# Altium schematic sheet MAX232&输出.SchDoc
size A4
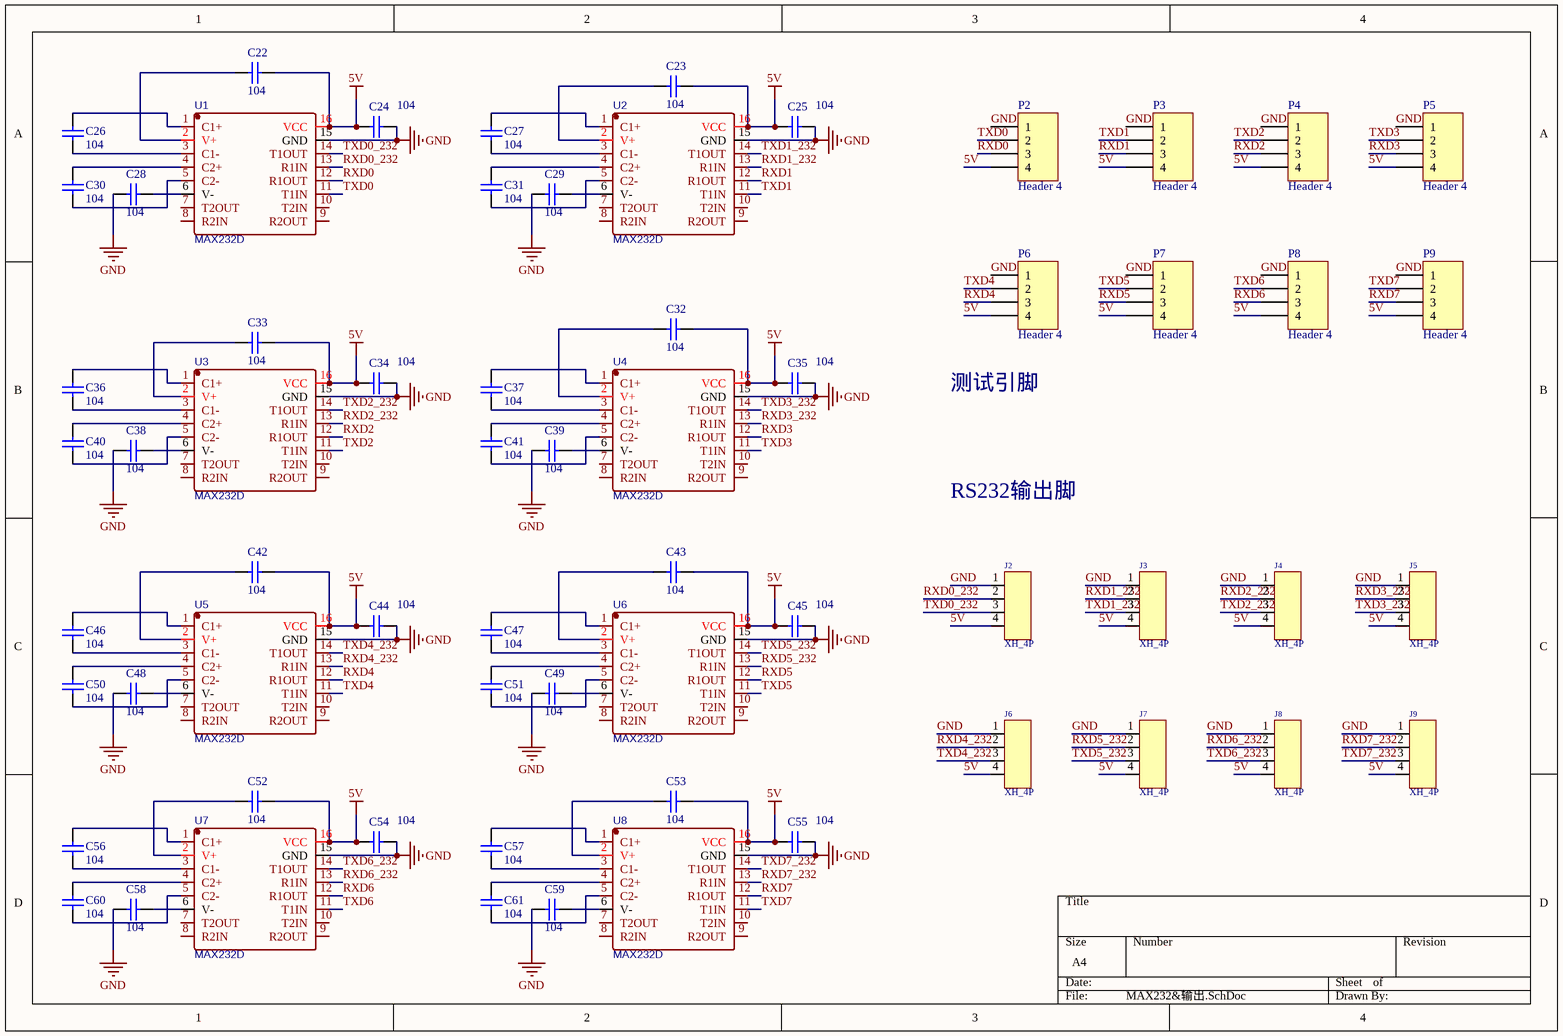
[diagram p0: MAX232&输出.SchDoc]

## Parts
C22  104  [0603_C]
C23  104  [0603_C]
C24  104  [0603_C]
C25  104  [0603_C]
C26  104  [0603_C]
C27  104  [0603_C]
C28  104  [0603_C]
C29  104  [0603_C]
C30  104  [0603_C]
C31  104  [0603_C]
C32  104  [0603_C]
C33  104  [0603_C]
C34  104  [0603_C]
C35  104  [0603_C]
C36  104  [0603_C]
C37  104  [0603_C]
C38  104  [0603_C]
C39  104  [0603_C]
C40  104  [0603_C]
C41  104  [0603_C]
C42  104  [0603_C]
C43  104  [0603_C]
C44  104  [0603_C]
C45  104  [0603_C]
C46  104  [0603_C]
C47  104  [0603_C]
C48  104  [0603_C]
C49  104  [0603_C]
C50  104  [0603_C]
C51  104  [0603_C]
C52  104  [0603_C]
C53  104  [0603_C]
C54  104  [0603_C]
C55  104  [0603_C]
C56  104  [0603_C]
C57  104  [0603_C]
C58  104  [0603_C]
C59  104  [0603_C]
C60  104  [0603_C]
C61  104  [0603_C]
J2  XH_4P  [XH_4P直插弯针]
J3  XH_4P  [XH_4P直插弯针]
J4  XH_4P  [XH_4P直插弯针]
J5  XH_4P  [XH_4P直插弯针]
J6  XH_4P  [XH_4P直插弯针]
J7  XH_4P  [XH_4P直插弯针]
J8  XH_4P  [XH_4P直插弯针]
J9  XH_4P  [XH_4P直插弯针]
P2  Header 4  [HDR1X4]
P3  Header 4  [HDR1X4]
P4  Header 4  [HDR1X4]
P5  Header 4  [HDR1X4]
P6  Header 4  [HDR1X4]
P7  Header 4  [HDR1X4]
P8  Header 4  [HDR1X4]
P9  Header 4  [HDR1X4]
U1  MAX232D  [SOIC-16_L9.9-W3.9-P1.27-LS6.0-BL]
U2  MAX232D  [SOIC-16_L9.9-W3.9-P1.27-LS6.0-BL]
U3  MAX232D  [SOIC-16_L9.9-W3.9-P1.27-LS6.0-BL]
U4  MAX232D  [SOIC-16_L9.9-W3.9-P1.27-LS6.0-BL]
U5  MAX232D  [SOIC-16_L9.9-W3.9-P1.27-LS6.0-BL]
U6  MAX232D  [SOIC-16_L9.9-W3.9-P1.27-LS6.0-BL]
U7  MAX232D  [SOIC-16_L9.9-W3.9-P1.27-LS6.0-BL]
U8  MAX232D  [SOIC-16_L9.9-W3.9-P1.27-LS6.0-BL]

## Nets
5V: C22.1 C23.1 C24.1 C25.1 C32.1 C33.1 C34.1 C35.1 C42.1 C43.1 C44.1 C45.1 C52.1 C53.1 C54.1 C55.1 J2.4 J3.4 J4.4 J5.4 J6.4 J7.4 J8.4 J9.4 P2.4 P3.4 P4.4 P5.4 P6.4 P7.4 P8.4 P9.4 U1.16(VCC) U2.16(VCC) U3.16(VCC) U4.16(VCC) U5.16(VCC) U6.16(VCC) U7.16(VCC) U8.16(VCC)
GND: C24.2 C25.2 C28.1 C29.1 C34.2 C35.2 C38.1 C39.1 C44.2 C45.2 C48.1 C49.1 C54.2 C55.2 C58.1 C59.1 J2.1 J3.1 J4.1 J5.1 J6.1 J7.1 J8.1 J9.1 P2.1 P3.1 P4.1 P5.1 P6.1 P7.1 P8.1 P9.1 U1.15(GND) U2.15(GND) U3.15(GND) U4.15(GND) U5.15(GND) U6.15(GND) U7.15(GND) U8.15(GND)
RXD0: P2.3 U1.12(R1OUT)
RXD0_232: J2.2 U1.13(R1IN)
RXD1: P3.3 U2.12(R1OUT)
RXD1_232: J3.2 U2.13(R1IN)
RXD2: P4.3 U3.12(R1OUT)
RXD2_232: J4.2 U3.13(R1IN)
RXD3: P5.3 U4.12(R1OUT)
RXD3_232: J5.2 U4.13(R1IN)
RXD4: P6.3 U5.12(R1OUT)
RXD4_232: J6.2 U5.13(R1IN)
RXD5: P7.3 U6.12(R1OUT)
RXD5_232: J7.2 U6.13(R1IN)
RXD6: P8.3 U7.12(R1OUT)
RXD6_232: J8.2 U7.13(R1IN)
RXD7: P9.3 U8.12(R1OUT)
RXD7_232: J9.2 U8.13(R1IN)
TXD0: P2.2 U1.11(T1IN)
TXD0_232: J2.3 U1.14(T1OUT)
TXD1: P3.2 U2.11(T1IN)
TXD1_232: J3.3 U2.14(T1OUT)
TXD2: P4.2 U3.11(T1IN)
TXD2_232: J4.3 U3.14(T1OUT)
TXD3: P5.2 U4.11(T1IN)
TXD3_232: J5.3 U4.14(T1OUT)
TXD4: P6.2 U5.11(T1IN)
TXD4_232: J6.3 U5.14(T1OUT)
TXD5: P7.2 U6.11(T1IN)
TXD5_232: J7.3 U6.14(T1OUT)
TXD6: P8.2 U7.11(T1IN)
TXD6_232: J8.3 U7.14(T1OUT)
TXD7: P9.2 U8.11(T1IN)
TXD7_232: J9.3 U8.14(T1OUT)
NetC22_2: C22.2 U1.2(V+)
NetC23_2: C23.2 U2.2(V+)
NetC26_1: C26.1 U1.3(C1-)
NetC26_2: C26.2 U1.1(C1+)
NetC27_1: C27.1 U2.3(C1-)
NetC27_2: C27.2 U2.1(C1+)
NetC28_2: C28.2 U1.6(V-)
NetC29_2: C29.2 U2.6(V-)
NetC30_1: C30.1 U1.5(C2-)
NetC30_2: C30.2 U1.4(C2+)
NetC31_1: C31.1 U2.5(C2-)
NetC31_2: C31.2 U2.4(C2+)
NetC32_2: C32.2 U4.2(V+)
NetC33_2: C33.2 U3.2(V+)
NetC36_1: C36.1 U3.3(C1-)
NetC36_2: C36.2 U3.1(C1+)
NetC37_1: C37.1 U4.3(C1-)
NetC37_2: C37.2 U4.1(C1+)
NetC38_2: C38.2 U3.6(V-)
NetC39_2: C39.2 U4.6(V-)
NetC40_1: C40.1 U3.5(C2-)
NetC40_2: C40.2 U3.4(C2+)
NetC41_1: C41.1 U4.5(C2-)
NetC41_2: C41.2 U4.4(C2+)
NetC42_2: C42.2 U5.2(V+)
NetC43_2: C43.2 U6.2(V+)
NetC46_1: C46.1 U5.3(C1-)
NetC46_2: C46.2 U5.1(C1+)
NetC47_1: C47.1 U6.3(C1-)
NetC47_2: C47.2 U6.1(C1+)
NetC48_2: C48.2 U5.6(V-)
NetC49_2: C49.2 U6.6(V-)
NetC50_1: C50.1 U5.5(C2-)
NetC50_2: C50.2 U5.4(C2+)
NetC51_1: C51.1 U6.5(C2-)
NetC51_2: C51.2 U6.4(C2+)
NetC52_2: C52.2 U7.2(V+)
NetC53_2: C53.2 U8.2(V+)
NetC56_1: C56.1 U7.3(C1-)
NetC56_2: C56.2 U7.1(C1+)
NetC57_1: C57.1 U8.3(C1-)
NetC57_2: C57.2 U8.1(C1+)
NetC58_2: C58.2 U7.6(V-)
NetC59_2: C59.2 U8.6(V-)
NetC60_1: C60.1 U7.5(C2-)
NetC60_2: C60.2 U7.4(C2+)
NetC61_1: C61.1 U8.5(C2-)
NetC61_2: C61.2 U8.4(C2+)

Not connected (* = marked no-connect by the designer): U1 7(T2OUT) 8(R2IN) 9(R2OUT) 10(T2IN); U2 7(T2OUT) 8(R2IN) 9(R2OUT) 10(T2IN); U3 7(T2OUT) 8(R2IN) 9(R2OUT) 10(T2IN); U4 7(T2OUT) 8(R2IN) 9(R2OUT) 10(T2IN); U5 7(T2OUT) 8(R2IN) 9(R2OUT) 10(T2IN); U6 7(T2OUT) 8(R2IN) 9(R2OUT) 10(T2IN); U7 7(T2OUT) 8(R2IN) 9(R2OUT) 10(T2IN); U8 7(T2OUT) 8(R2IN) 9(R2OUT) 10(T2IN)

## Notes on the sheet
- 测试引脚
- RS232输出脚

## Library data of the parts
C22-C61 = 0603 100nF (104) 10% 50V: 贴片电容; ComponentLink1Description: 供应商链接; ComponentLink1URL: http://www.szlcsc.com/product/details_15331.html; Package: 0603; Supplier: LC; SuppliersPartNumber: C14663
P2-P9 = Header 4: Header, 4-Pin; LatestRevisionDate: 17-Jul-2002; LatestRevisionNote: Re-released for DXP Platform.; Publisher: Altium Limited
U1-U8 = MAX232D: BOM_Manufacturer: Texas Instruments; Contributor: LCSC; BOM_Supplier: LCSC; BOM_Supplier Part: C350552; BOM_Manufacturer Part: MAX232D; BOM_JLCPCB Part Class: Extended Part; spicePre: U; spiceSymbolName: MAX232D